# EAGLE schematic loa (EAGLE 5.11)

## Sheet 1 of 7
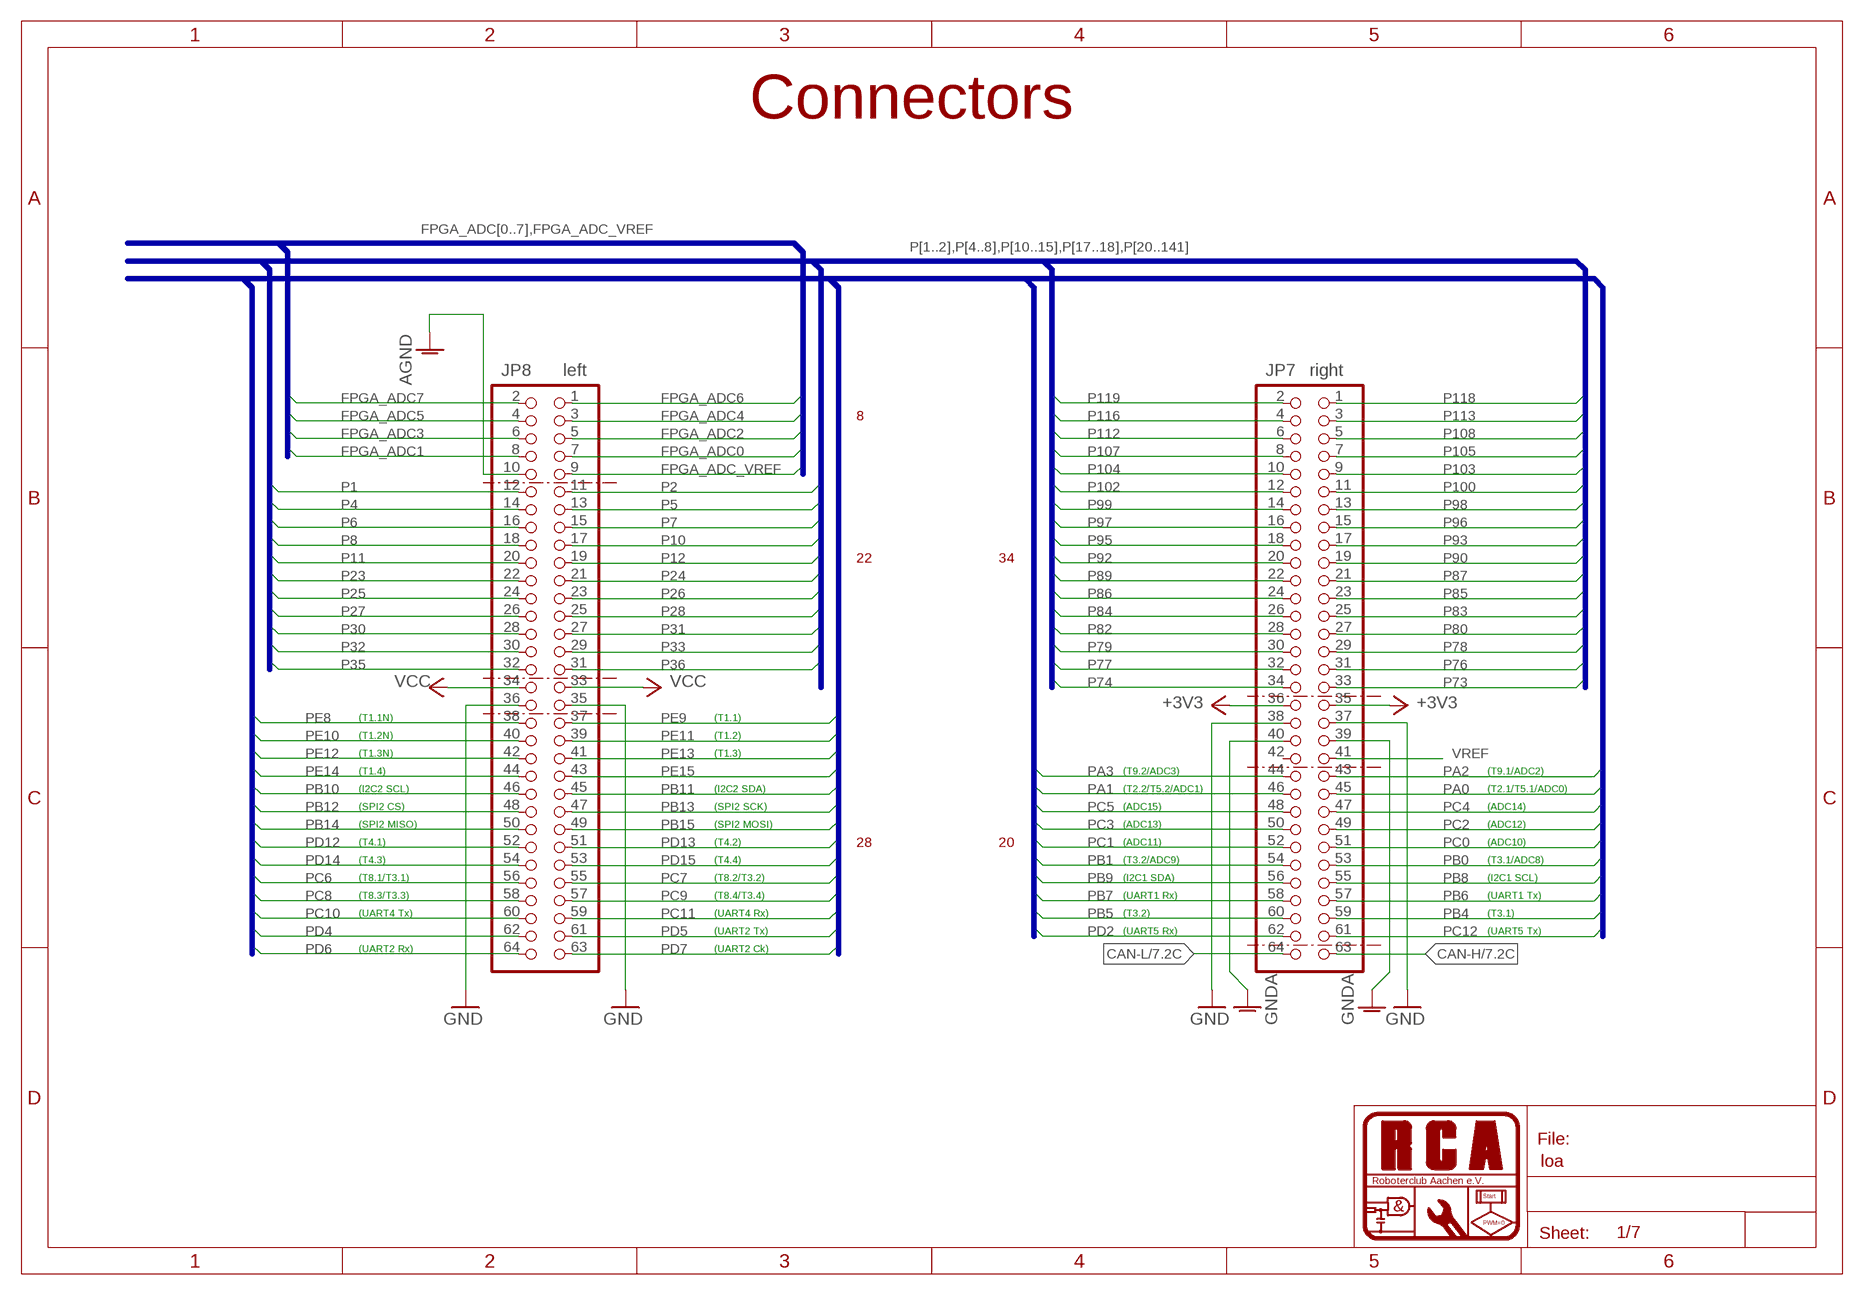
[diagram p0: schematic, sheet 1]

### Parts
JP7  right  PINHD-2X32_2.00-SMD  [2X32M_SMD]
JP8  left  PINHD-2X32_2.00-SMD  [2X32M_SMD]

### Nets
+3V3: JP7.35 JP7.36 ; also sheet 2,3,4,5,6,7
AGND: JP8.10 ; also sheet 3
CAN-H: JP7.63 ; also sheet 7
CAN-L: JP7.64 ; also sheet 7
FPGA_ADC0: JP8.7 ; also sheet 3
FPGA_ADC1: JP8.8 ; also sheet 3
FPGA_ADC2: JP8.5 ; also sheet 3
FPGA_ADC3: JP8.6 ; also sheet 3
FPGA_ADC4: JP8.3 ; also sheet 3
FPGA_ADC5: JP8.4 ; also sheet 3
FPGA_ADC6: JP8.1 ; also sheet 3
FPGA_ADC7: JP8.2 ; also sheet 3
FPGA_ADC_VREF: JP8.9 ; also sheet 3
GND: JP7.37 JP7.38 JP8.35 JP8.36 ; also sheet 2,3,4,5,6,7
GNDA: JP7.39 JP7.40 ; also sheet 6
P1: JP8.12 ; also sheet 2
P2: JP8.11 ; also sheet 2
P4: JP8.14 ; also sheet 2
P5: JP8.13 ; also sheet 2
P6: JP8.16 ; also sheet 2
P7: JP8.15 ; also sheet 2
P8: JP8.18 ; also sheet 2
P10: JP8.17 ; also sheet 2
P11: JP8.20 ; also sheet 2
P12: JP8.19 ; also sheet 2
P23: JP8.22 ; also sheet 2
P24: JP8.21 ; also sheet 2
P25: JP8.24 ; also sheet 2
P26: JP8.23 ; also sheet 2
P27: JP8.26 ; also sheet 2
P28: JP8.25 ; also sheet 2
P30: JP8.28 ; also sheet 2
P31: JP8.27 ; also sheet 2
P32: JP8.30 ; also sheet 2
P33: JP8.29 ; also sheet 2
P35: JP8.32 ; also sheet 2
P36: JP8.31 ; also sheet 2
P73: JP7.33 ; also sheet 2
P74: JP7.34 ; also sheet 2
P76: JP7.31 ; also sheet 2
P77: JP7.32 ; also sheet 2
P78: JP7.29 ; also sheet 2
P79: JP7.30 ; also sheet 2
P80: JP7.27 ; also sheet 2
P82: JP7.28 ; also sheet 2
P83: JP7.25 ; also sheet 2
P84: JP7.26 ; also sheet 2
P85: JP7.23 ; also sheet 2
P86: JP7.24 ; also sheet 2
P87: JP7.21 ; also sheet 2
P89: JP7.22 ; also sheet 2
P90: JP7.19 ; also sheet 2
P92: JP7.20 ; also sheet 2
P93: JP7.17 ; also sheet 2
P95: JP7.18 ; also sheet 2
P96: JP7.15 ; also sheet 2
P97: JP7.16 ; also sheet 2
P98: JP7.13 ; also sheet 2
P99: JP7.14 ; also sheet 2
P100: JP7.11 ; also sheet 2
P102: JP7.12 ; also sheet 2
P103: JP7.9 ; also sheet 2
P104: JP7.10 ; also sheet 2
P105: JP7.7 ; also sheet 2
P107: JP7.8 ; also sheet 2
P108: JP7.5 ; also sheet 2
P112: JP7.6 ; also sheet 2
P113: JP7.3 ; also sheet 2
P116: JP7.4 ; also sheet 2
P118: JP7.1 ; also sheet 2
P119: JP7.2 ; also sheet 2
PA0: JP7.45 ; also sheet 5
PA1: JP7.46 ; also sheet 5
PA2: JP7.43 ; also sheet 5
PA3: JP7.44 ; also sheet 5
PB0: JP7.53 ; also sheet 5
PB1: JP7.54 ; also sheet 5
PB4: JP7.59 ; also sheet 5
PB5: JP7.60 ; also sheet 5
PB6: JP7.57 ; also sheet 5
PB7: JP7.58 ; also sheet 5
PB8: JP7.55 ; also sheet 5
PB9: JP7.56 ; also sheet 5
PB10: JP8.46 ; also sheet 5
PB11: JP8.45 ; also sheet 5
PB12: JP8.48 ; also sheet 5
PB13: JP8.47 ; also sheet 5
PB14: JP8.50 ; also sheet 5
PB15: JP8.49 ; also sheet 5
PC0: JP7.51 ; also sheet 5
PC1: JP7.52 ; also sheet 5
PC2: JP7.49 ; also sheet 5
PC3: JP7.50 ; also sheet 5
PC4: JP7.47 ; also sheet 5
PC5: JP7.48 ; also sheet 5
PC6: JP8.56 ; also sheet 5
PC7: JP8.55 ; also sheet 5
PC8: JP8.58 ; also sheet 5
PC9: JP8.57 ; also sheet 5
PC10: JP8.60 ; also sheet 5
PC11: JP8.59 ; also sheet 5
PC12: JP7.61 ; also sheet 5
PD2: JP7.62 ; also sheet 5
PD4: JP8.62 ; also sheet 5
PD5: JP8.61 ; also sheet 5
PD6: JP8.64 ; also sheet 5
PD7: JP8.63 ; also sheet 5
PD12: JP8.52 ; also sheet 5
PD13: JP8.51 ; also sheet 5
PD14: JP8.54 ; also sheet 5
PD15: JP8.53 ; also sheet 5
PE8: JP8.38 ; also sheet 5
PE9: JP8.37 ; also sheet 5
PE10: JP8.40 ; also sheet 5
PE11: JP8.39 ; also sheet 5
PE12: JP8.42 ; also sheet 5
PE13: JP8.41 ; also sheet 5
PE14: JP8.44 ; also sheet 5
PE15: JP8.43 ; also sheet 5
VCC: JP8.33 JP8.34 ; also sheet 4
VREF: JP7.41 ; also sheet 6
Unconnected: JP7.42

### Buses
FPGA_ADC[0..7],FPGA_ADC_VREF
P[1..2],P[4..8],P[10..15],P[17..18],P[20..141]
PA[0..3],PA8,PB[0..2],PB[4..15],PC[0..12],PC14,FLASH_CS,PD2,SD_CS,PD[4..7],PD[12..15],PE[0..15]

### Notes on the sheet
- Connectors
- 8
- 22 | 34
- (T1.1N) | (T1.1)
- (T1.2N) | (T1.2)
- (T1.3N) | (T1.3)
- (T1.4) | (T9.2/ADC3) | (T9.1/ADC2)
- (I2C2 SCL) | (I2C2 SDA) | (T2.2/T5.2/ADC1) | (T2.1/T5.1/ADC0)
- (SPI2 CS) | (SPI2 SCK) | (ADC15) | (ADC14)
- (SPI2 MISO) | (SPI2 MOSI) | (ADC13) | (ADC12)
- (T4.1) | (T4.2) | 28 | 20 | (ADC11) | (ADC10)
- (T4.3) | (T4.4) | (T3.2/ADC9) | (T3.1/ADC8)
- (T8.1/T3.1) | (T8.2/T3.2) | (I2C1 SDA) | (I2C1 SCL)
- (T8.3/T3.3) | (T8.4/T3.4) | (UART1 Rx) | (UART1 Tx)
- (UART4 Tx) | (UART4 Rx) | (T3.2) | (T3.1)
- (UART2 Tx) | (UART5 Rx) | (UART5 Tx)
- (UART2 Rx) | (UART2 Ck)

## Sheet 2 of 7
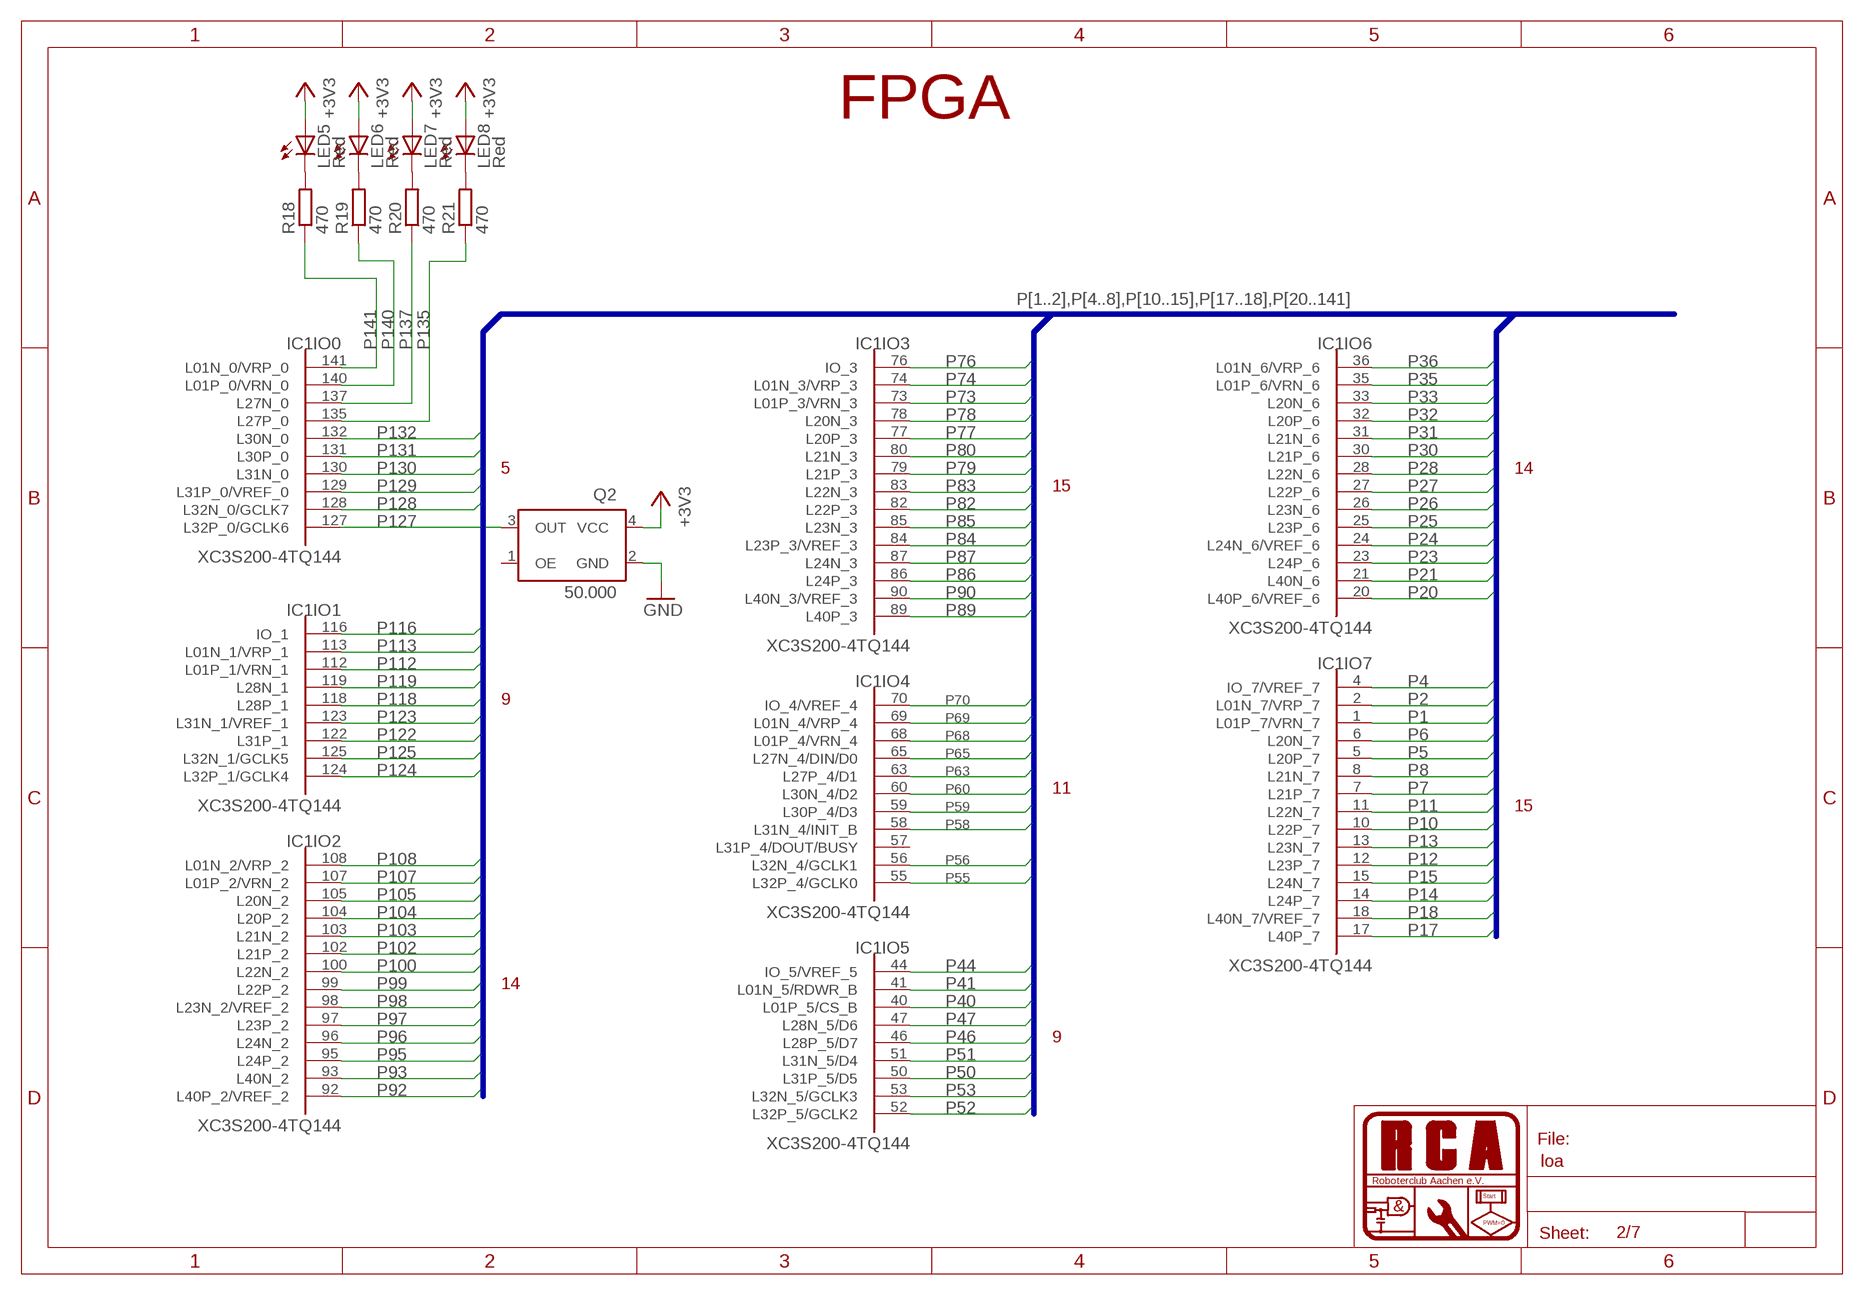
[diagram p1: schematic, sheet 2]

### Parts
IC1  XC3S200-4TQ144  [TQ144]
LED5  Red  LEDCHIPLED_0805  [CHIPLED_0805]
LED6  Red  LEDCHIPLED_0805  [CHIPLED_0805]
LED7  Red  LEDCHIPLED_0805  [CHIPLED_0805]
LED8  Red  LEDCHIPLED_0805  [CHIPLED_0805]
Q2  50.000  XO53  [XO53]
R18  470  R-EU_R0805  [R0805]
R19  470  R-EU_R0805  [R0805]
R20  470  R-EU_R0805  [R0805]
R21  470  R-EU_R0805  [R0805]

### Nets
+3V3: LED5.A LED6.A LED7.A LED8.A Q2.4(VCC) ; also sheet 1,3,4,5,6,7
GND: Q2.2(GND) ; also sheet 1,3,4,5,6,7
N$22: LED8.C R21.2
N$23: LED7.C R20.2
N$24: LED6.C R19.2
N$25: LED5.C R18.2
P1: IC1.1(IO7:L01P_7/VRN_7) ; also sheet 1
P2: IC1.2(IO7:L01N_7/VRP_7) ; also sheet 1
P4: IC1.4(IO7:IO_7/VREF_7) ; also sheet 1
P5: IC1.5(IO7:L20P_7) ; also sheet 1
P6: IC1.6(IO7:L20N_7) ; also sheet 1
P7: IC1.7(IO7:L21P_7) ; also sheet 1
P8: IC1.8(IO7:L21N_7) ; also sheet 1
P10: IC1.10(IO7:L22P_7) ; also sheet 1
P11: IC1.11(IO7:L22N_7) ; also sheet 1
P12: IC1.12(IO7:L23P_7) ; also sheet 1
P13: IC1.13(IO7:L23N_7)
P14: IC1.14(IO7:L24P_7)
P15: IC1.15(IO7:L24N_7)
P17: IC1.17(IO7:L40P_7)
P18: IC1.18(IO7:L40N_7/VREF_7)
P20: IC1.20(IO6:L40P_6/VREF_6) ; also sheet 3
P21: IC1.21(IO6:L40N_6) ; also sheet 3
P23: IC1.23(IO6:L24P_6) ; also sheet 1
P24: IC1.24(IO6:L24N_6/VREF_6) ; also sheet 1
P25: IC1.25(IO6:L23P_6) ; also sheet 1
P26: IC1.26(IO6:L23N_6) ; also sheet 1
P27: IC1.27(IO6:L22P_6) ; also sheet 1
P28: IC1.28(IO6:L22N_6) ; also sheet 1
P30: IC1.30(IO6:L21P_6) ; also sheet 1
P31: IC1.31(IO6:L21N_6) ; also sheet 1
P32: IC1.32(IO6:L20P_6) ; also sheet 1
P33: IC1.33(IO6:L20N_6) ; also sheet 1
P35: IC1.35(IO6:L01P_6/VRN_6) ; also sheet 1
P36: IC1.36(IO6:L01N_6/VRP_6) ; also sheet 1
P40: IC1.40(IO5:L01P_5/CS_B)
P41: IC1.41(IO5:L01N_5/RDWR_B)
P44: IC1.44(IO5:IO_5/VREF_5)
P46: IC1.46(IO5:L28P_5/D7)
P47: IC1.47(IO5:L28N_5/D6)
P50: IC1.50(IO5:L31P_5/D5)
P51: IC1.51(IO5:L31N_5/D4)
P52: IC1.52(IO5:L32P_5/GCLK2)
P53: IC1.53(IO5:L32N_5/GCLK3) ; also sheet 3
P55: IC1.55(IO4:L32P_4/GCLK0) ; also sheet 3
P56: IC1.56(IO4:L32N_4/GCLK1) ; also sheet 3
P58: IC1.58(IO4:L31N_4/INIT_B) ; also sheet 3
P59: IC1.59(IO4:L30P_4/D3) ; also sheet 3
P60: IC1.60(IO4:L30N_4/D2) ; also sheet 3
P63: IC1.63(IO4:L27P_4/D1) ; also sheet 3
P65: IC1.65(IO4:L27N_4/DIN/D0) ; also sheet 3
P68: IC1.68(IO4:L01P_4/VRN_4)
P69: IC1.69(IO4:L01N_4/VRP_4)
P70: IC1.70(IO4:IO_4/VREF_4)
P73: IC1.73(IO3:L01P_3/VRN_3) ; also sheet 1
P74: IC1.74(IO3:L01N_3/VRP_3) ; also sheet 1
P76: IC1.76(IO3:IO_3) ; also sheet 1
P77: IC1.77(IO3:L20P_3) ; also sheet 1
P78: IC1.78(IO3:L20N_3) ; also sheet 1
P79: IC1.79(IO3:L21P_3) ; also sheet 1
P80: IC1.80(IO3:L21N_3) ; also sheet 1
P82: IC1.82(IO3:L22P_3) ; also sheet 1
P83: IC1.83(IO3:L22N_3) ; also sheet 1
P84: IC1.84(IO3:L23P_3/VREF_3) ; also sheet 1
P85: IC1.85(IO3:L23N_3) ; also sheet 1
P86: IC1.86(IO3:L24P_3) ; also sheet 1
P87: IC1.87(IO3:L24N_3) ; also sheet 1
P89: IC1.89(IO3:L40P_3) ; also sheet 1
P90: IC1.90(IO3:L40N_3/VREF_3) ; also sheet 1
P92: IC1.92(IO2:L40P_2/VREF_2) ; also sheet 1
P93: IC1.93(IO2:L40N_2) ; also sheet 1
P95: IC1.95(IO2:L24P_2) ; also sheet 1
P96: IC1.96(IO2:L24N_2) ; also sheet 1
P97: IC1.97(IO2:L23P_2) ; also sheet 1
P98: IC1.98(IO2:L23N_2/VREF_2) ; also sheet 1
P99: IC1.99(IO2:L22P_2) ; also sheet 1
P100: IC1.100(IO2:L22N_2) ; also sheet 1
P102: IC1.102(IO2:L21P_2) ; also sheet 1
P103: IC1.103(IO2:L21N_2) ; also sheet 1
P104: IC1.104(IO2:L20P_2) ; also sheet 1
P105: IC1.105(IO2:L20N_2) ; also sheet 1
P107: IC1.107(IO2:L01P_2/VRN_2) ; also sheet 1
P108: IC1.108(IO2:L01N_2/VRP_2) ; also sheet 1
P112: IC1.112(IO1:L01P_1/VRN_1) ; also sheet 1
P113: IC1.113(IO1:L01N_1/VRP_1) ; also sheet 1
P116: IC1.116(IO1:IO_1) ; also sheet 1
P118: IC1.118(IO1:L28P_1) ; also sheet 1
P119: IC1.119(IO1:L28N_1) ; also sheet 1
P122: IC1.122(IO1:L31P_1) ; also sheet 3
P123: IC1.123(IO1:L31N_1/VREF_1) ; also sheet 3
P124: IC1.124(IO1:L32P_1/GCLK4) ; also sheet 3
P125: IC1.125(IO1:L32N_1/GCLK5) ; also sheet 3
P127: IC1.127(IO0:L32P_0/GCLK6) Q2.3(OUT)
P128: IC1.128(IO0:L32N_0/GCLK7)
P129: IC1.129(IO0:L31P_0/VREF_0)
P130: IC1.130(IO0:L31N_0)
P131: IC1.131(IO0:L30P_0)
P132: IC1.132(IO0:L30N_0)
P135: IC1.135(IO0:L27P_0) R21.1
P137: IC1.137(IO0:L27N_0) R20.1
P140: IC1.140(IO0:L01P_0/VRN_0) R19.1
P141: IC1.141(IO0:L01N_0/VRP_0) R18.1
Unconnected: IC1.57(IO4:L31P_4/DOUT/BUSY) Q2.1(OE)

### Buses
P[1..2],P[4..8],P[10..15],P[17..18],P[20..141]

### Notes on the sheet
- FPGA
- 5 | 14
- 15
- 9
- 11
- 15
- 14
- 9

## Sheet 3 of 7
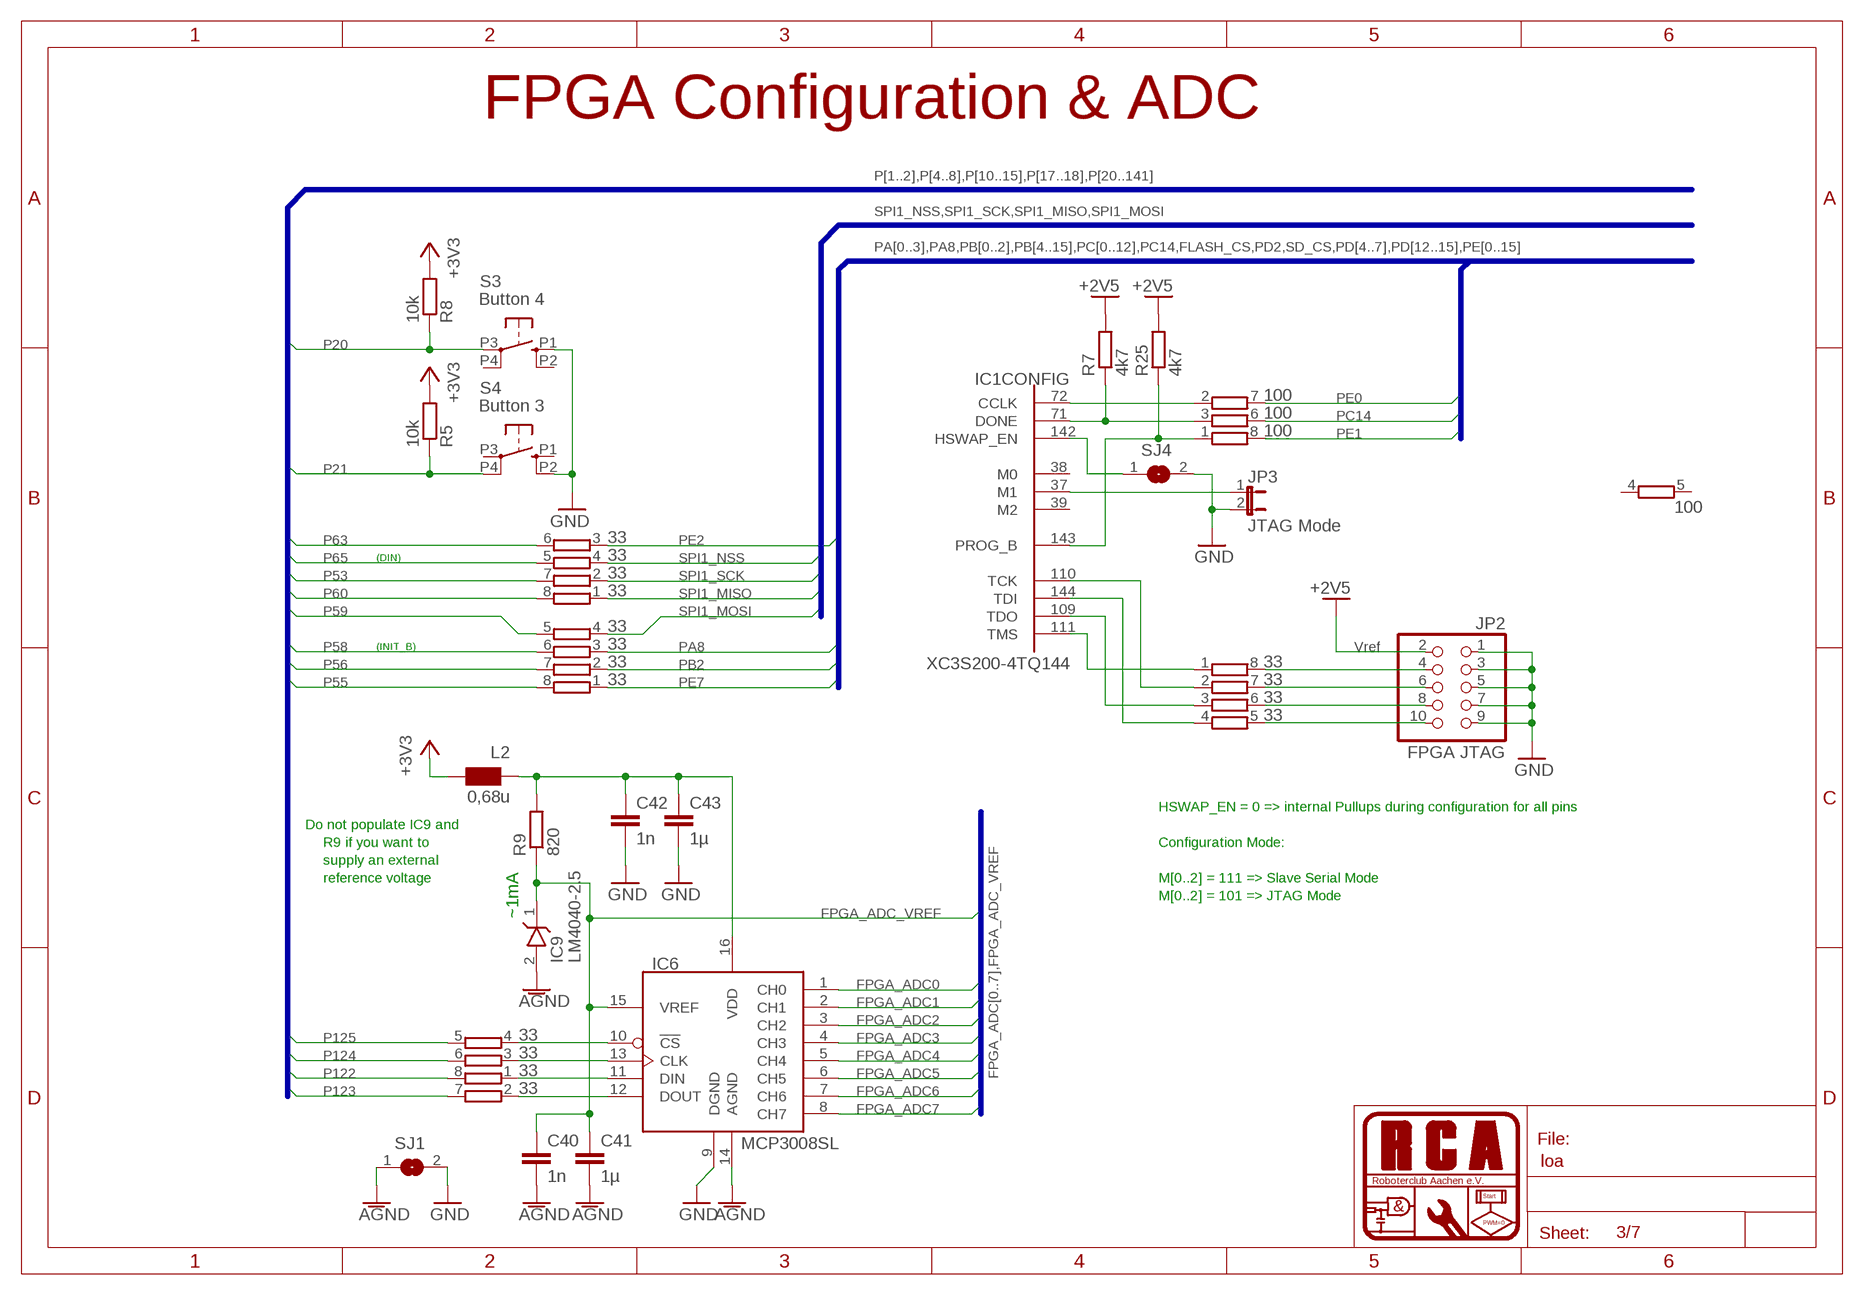
[diagram p2: schematic, sheet 3]

### Parts
C40  1n  C-EUC0603  [C0603]
C41  1µ  C-EUC0805  [C0805]
C42  1n  C-EUC0603  [C0603]
C43  1µ  C-EUC0805  [C0805]
IC6  MCP3008SL  [SO16]
IC9  LM4040-2.5  LM4040  [SOT23]
JP2  FPGA JTAG  PINHD-2X5_2.54-SMD  [2X05SMD]
JP3  JTAG Mode  JP1E  [JP1]
L2  0,68u  WE-KIHQ_0805  [WE-KI_0805_B]
R5  10k  R-EU_R0805  [R0805]
R7  4k7  R-EU_R0805  [R0805]
R8  10k  R-EU_R0805  [R0805]
R9  820  R-EU_R0805  [R0805]
R25  4k7  R-EU_R0805  [R0805]
RN1  33  4R-NEXB38V  [EXB38V]
RN2  33  4R-NEXB38V  [EXB38V]
RN3  33  4R-NEXB38V  [EXB38V]
RN4  100  4R-NEXB38V  [EXB38V]
RN5  33  4R-NEXB38V  [EXB38V]
S3  Button 4  10-XXLSH  [B3F-10XX-SMD]
S4  Button 3  10-XXLSH  [B3F-10XX-SMD]
SJ1  SJ  [SJ]
SJ4  SJ  [SJ]

### Nets
+2V5: JP2.2 R7.2 R25.2 ; also sheet 4
+3V3: L2.1 R5.2 R8.2 ; also sheet 1,2,4,5,6,7
AGND: C40.2 C41.2 IC6.14(AGND) IC9.2(A) SJ1.1 ; also sheet 1
FPGA_ADC0: IC6.1(CH0) ; also sheet 1
FPGA_ADC1: IC6.2(CH1) ; also sheet 1
FPGA_ADC2: IC6.3(CH2) ; also sheet 1
FPGA_ADC3: IC6.4(CH3) ; also sheet 1
FPGA_ADC4: IC6.5(CH4) ; also sheet 1
FPGA_ADC5: IC6.6(CH5) ; also sheet 1
FPGA_ADC6: IC6.7(CH6) ; also sheet 1
FPGA_ADC7: IC6.8(CH7) ; also sheet 1
FPGA_ADC_VREF: C40.1 C41.1 IC6.15(VREF) IC9.1(C) R9.1 ; also sheet 1
GND: C42.2 C43.2 IC6.9(DGND) JP2.1 JP2.3 JP2.5 JP2.7 JP2.9 JP3.2 S3.P1(S) S4.P2(S1) SJ1.2 SJ4.2 ; also sheet 1,2,4,5,6,7
N$2: IC1.143(CONFIG:PROG_B) R25.1 RN4.1
N$3: IC1.71(CONFIG:DONE) R7.1 RN4.3
N$5: IC1.37(CONFIG:M1) JP3.1
N$6: IC1.142(CONFIG:HSWAP_EN) SJ4.1
N$7: IC1.72(CONFIG:CCLK) RN4.2
N$8: IC1.110(CONFIG:TCK) RN3.2
N$9: IC1.144(CONFIG:TDI) RN3.4
N$10: IC1.109(CONFIG:TDO) RN3.3
N$11: IC1.111(CONFIG:TMS) RN3.1
N$12: JP2.6 RN3.7
N$13: JP2.8 RN3.6
N$14: JP2.10 RN3.5
N$15: JP2.4 RN3.8
N$32: IC6.11(DIN) RN5.1
N$37: C42.1 C43.1 IC6.16(VDD) L2.2 R9.2
N$38: IC6.13(CLK) RN5.3
N$39: IC6.12(DOUT) RN5.2
N$41: IC6.10(!CS) RN5.4
P20: R8.1 S3.P3(P) ; also sheet 2
P21: R5.1 S4.P4(P1) ; also sheet 2
P53: RN1.7 ; also sheet 2
P55: RN2.8 ; also sheet 2
P56: RN2.7 ; also sheet 2
P58: RN2.6 ; also sheet 2
P59: RN2.5 ; also sheet 2
P60: RN1.8 ; also sheet 2
P63: RN1.6 ; also sheet 2
P65: RN1.5 ; also sheet 2
P122: RN5.8 ; also sheet 2
P123: RN5.7 ; also sheet 2
P124: RN5.6 ; also sheet 2
P125: RN5.5 ; also sheet 2
PA8: RN2.3 ; also sheet 5
PB2: RN2.2 ; also sheet 5
PC14: RN4.6 ; also sheet 5
PE0: RN4.7 ; also sheet 5
PE1: RN4.8 ; also sheet 5
PE2: RN1.3 ; also sheet 5
PE7: RN2.1 ; also sheet 5
SPI1_MISO: RN1.1 ; also sheet 5
SPI1_MOSI: RN2.4 ; also sheet 5
SPI1_NSS: RN1.4 ; also sheet 5
SPI1_SCK: RN1.2 ; also sheet 5
Unconnected: IC1.38(CONFIG:M0) IC1.39(CONFIG:M2) RN4.4 RN4.5 S3.P2(S1) S3.P4(P1) S4.P1(S) S4.P3(P)

### Buses
P[1..2],P[4..8],P[10..15],P[17..18],P[20..141]
SPI1_NSS,SPI1_SCK,SPI1_MISO,SPI1_MOSI
PA[0..3],PA8,PB[0..2],PB[4..15],PC[0..12],PC14,FLASH_CS,PD2,SD_CS,PD[4..7],PD[12..15],PE[0..15]
FPGA_ADC[0..7],FPGA_ADC_VREF

### Notes on the sheet
- FPGA Configuration & ADC
- (DIN)
- (INIT_B) | Vref
- HSWAP_EN = 0 => internal Pullups during configuration for all pins
- Do not populate IC9 and
- R9 if you want to | Configuration Mode:
- supply an external
- reference voltage | M[0..2] = 111 => Slave Serial Mode
- M[0..2] = 101 => JTAG Mode
- ~1mA

## Sheet 4 of 7
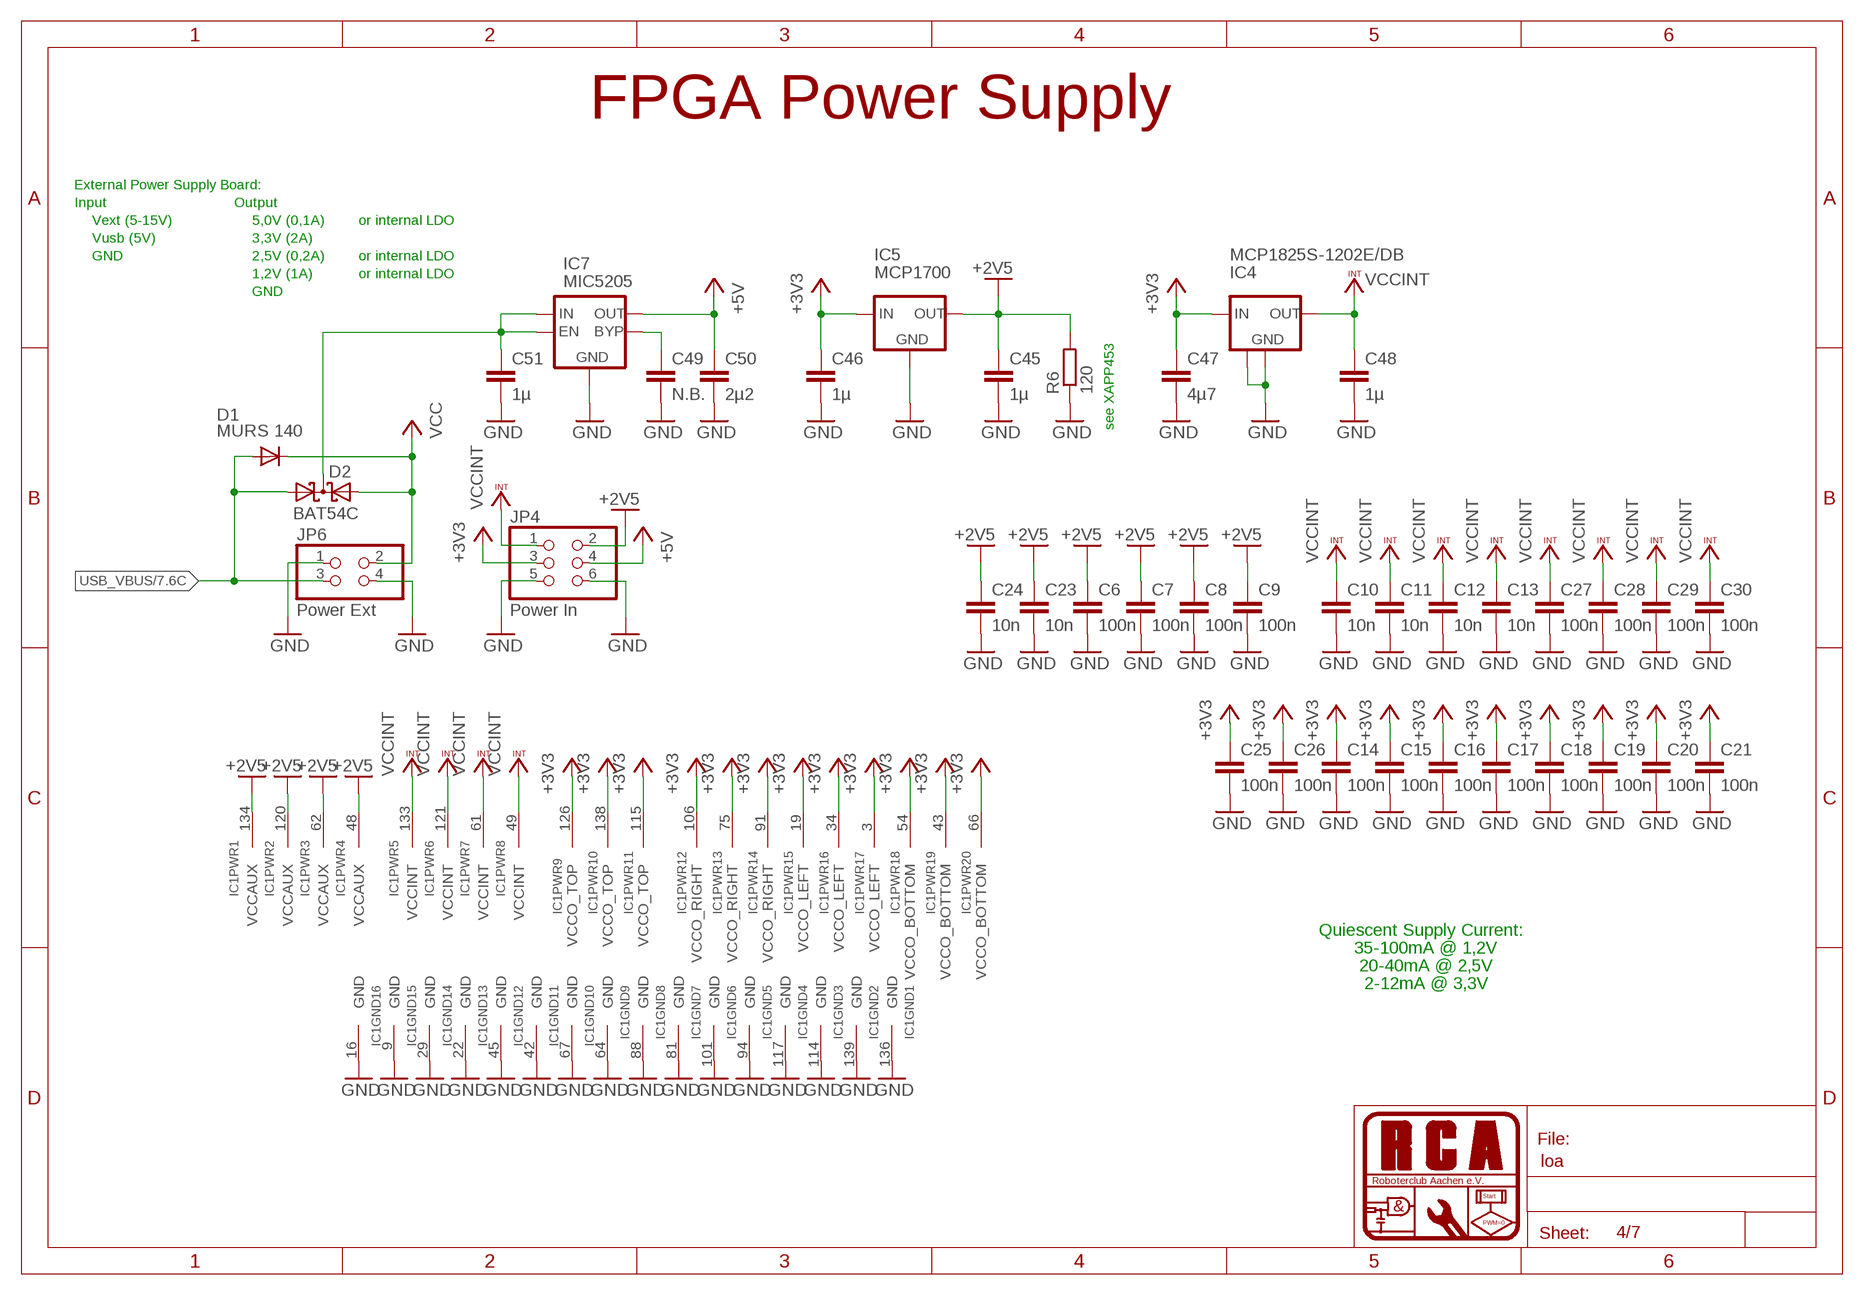
[diagram p3: schematic, sheet 4]

### Parts
C6  100n  C-EUC0603  [C0603]
C7  100n  C-EUC0603  [C0603]
C8  100n  C-EUC0603  [C0603]
C9  100n  C-EUC0603  [C0603]
C10  10n  C-EUC0603  [C0603]
C11  10n  C-EUC0603  [C0603]
C12  10n  C-EUC0603  [C0603]
C13  10n  C-EUC0603  [C0603]
C14  100n  C-EUC0603  [C0603]
C15  100n  C-EUC0603  [C0603]
C16  100n  C-EUC0603  [C0603]
C17  100n  C-EUC0603  [C0603]
C18  100n  C-EUC0603  [C0603]
C19  100n  C-EUC0603  [C0603]
C20  100n  C-EUC0603  [C0603]
C21  100n  C-EUC0603  [C0603]
C23  10n  C-EUC0603  [C0603]
C24  10n  C-EUC0603  [C0603]
C25  100n  C-EUC0603  [C0603]
C26  100n  C-EUC0603  [C0603]
C27  100n  C-EUC0603  [C0603]
C28  100n  C-EUC0603  [C0603]
C29  100n  C-EUC0603  [C0603]
C30  100n  C-EUC0603  [C0603]
C45  1µ  C-EUC0805  [C0805]
C46  1µ  C-EUC0805  [C0805]
C47  4µ7  C-EUC0805  [C0805]
C48  1µ  C-EUC0805  [C0805]
C49  N.B.  C-EUC0805  [C0805]
C50  2µ2  C-EUC0805  [C0805]
C51  1µ  C-EUC0805  [C0805]
D1  MURS 140  DIODE-SMB  [SMB]
D2  BAT54C  [SOT23]
IC4  MCP1825S-1202E/DB  MCP1825DB  [SOT223]
IC5  MCP1700  [SOT23]
IC7  MIC5205  [SOT23-5L]
JP4  Power In  PINHD-2X3_2.54  [2X03]
JP6  Power Ext  PINHD-2X2_2.54  [2X02]
R6  120  R-EU_M0805  [M0805]

### Nets
+2V5: C6.1 C7.1 C8.1 C9.1 C23.1 C24.1 C45.1 IC1.48(PWR4:VCCAUX) IC1.62(PWR3:VCCAUX) IC1.120(PWR2:VCCAUX) IC1.134(PWR1:VCCAUX) IC5.2(OUT) JP4.2 R6.2 ; also sheet 3
+3V3: C14.1 C15.1 C16.1 C17.1 C18.1 C19.1 C20.1 C21.1 C25.1 C26.1 C46.1 C47.1 IC1.3(PWR17:VCCO_LEFT) IC1.19(PWR15:VCCO_LEFT) IC1.34(PWR16:VCCO_LEFT) IC1.43(PWR19:VCCO_BOTTOM) IC1.54(PWR18:VCCO_BOTTOM) IC1.66(PWR20:VCCO_BOTTOM) IC1.75(PWR13:VCCO_RIGHT) IC1.91(PWR14:VCCO_RIGHT) IC1.106(PWR12:VCCO_RIGHT) IC1.115(PWR11:VCCO_TOP) IC1.126(PWR9:VCCO_TOP) IC1.138(PWR10:VCCO_TOP) IC4.1(IN) IC5.3(IN) JP4.3 ; also sheet 1,2,3,5,6,7
+5V: C50.1 IC7.5(OUT) JP4.4 ; also sheet 7
GND: C6.2 C7.2 C8.2 C9.2 C10.2 C11.2 C12.2 C13.2 C14.2 C15.2 C16.2 C17.2 C18.2 C19.2 C20.2 C21.2 C23.2 C24.2 C25.2 C26.2 C27.2 C28.2 C29.2 C30.2 C45.2 C46.2 C47.2 C48.2 C49.2 C50.2 C51.2 IC1.9(GND15:GND) IC1.16(GND16:GND) IC1.22(GND13:GND) IC1.29(GND14:GND) IC1.42(GND11:GND) IC1.45(GND12:GND) IC1.64(GND9:GND) IC1.67(GND10:GND) IC1.81(GND7:GND) IC1.88(GND8:GND) IC1.94(GND5:GND) IC1.101(GND6:GND) IC1.114(GND3:GND) IC1.117(GND4:GND) IC1.136(GND1:GND) IC1.139(GND2:GND) IC4.2(GND) IC4.4(GND) IC5.1(GND) IC7.2(GND) JP4.5 JP4.6 JP6.1 JP6.4 R6.1 ; also sheet 1,2,3,5,6,7
N$40: C49.1 IC7.4(BYP)
N$43: C51.1 D2.3(CC) IC7.1(IN) IC7.3(EN)
USB_VBUS: D1.A D2.1(A1) JP6.3 ; also sheet 5,7
VCC: D1.C D2.2(A2) JP6.2 ; also sheet 1
VCCINT: C10.1 C11.1 C12.1 C13.1 C27.1 C28.1 C29.1 C30.1 C48.1 IC1.49(PWR8:VCCINT) IC1.61(PWR7:VCCINT) IC1.121(PWR6:VCCINT) IC1.133(PWR5:VCCINT) IC4.3(OUT) JP4.1

### Notes on the sheet
- FPGA Power Supply
- External Power Supply Board:
- Input | Output
- Vext (5-15V) | 5,0V (0,1A) | or internal LDO
- Vusb (5V) | 3,3V (2A)
- GND | 2,5V (0,2A) | or internal LDO
- 1,2V (1A) | or internal LDO
- GND
- see XAPP453
- Quiescent Supply Current:
- 35-100mA @ 1,2V
- 20-40mA @ 2,5V
- 2-12mA @ 3,3V

## Sheet 5 of 7
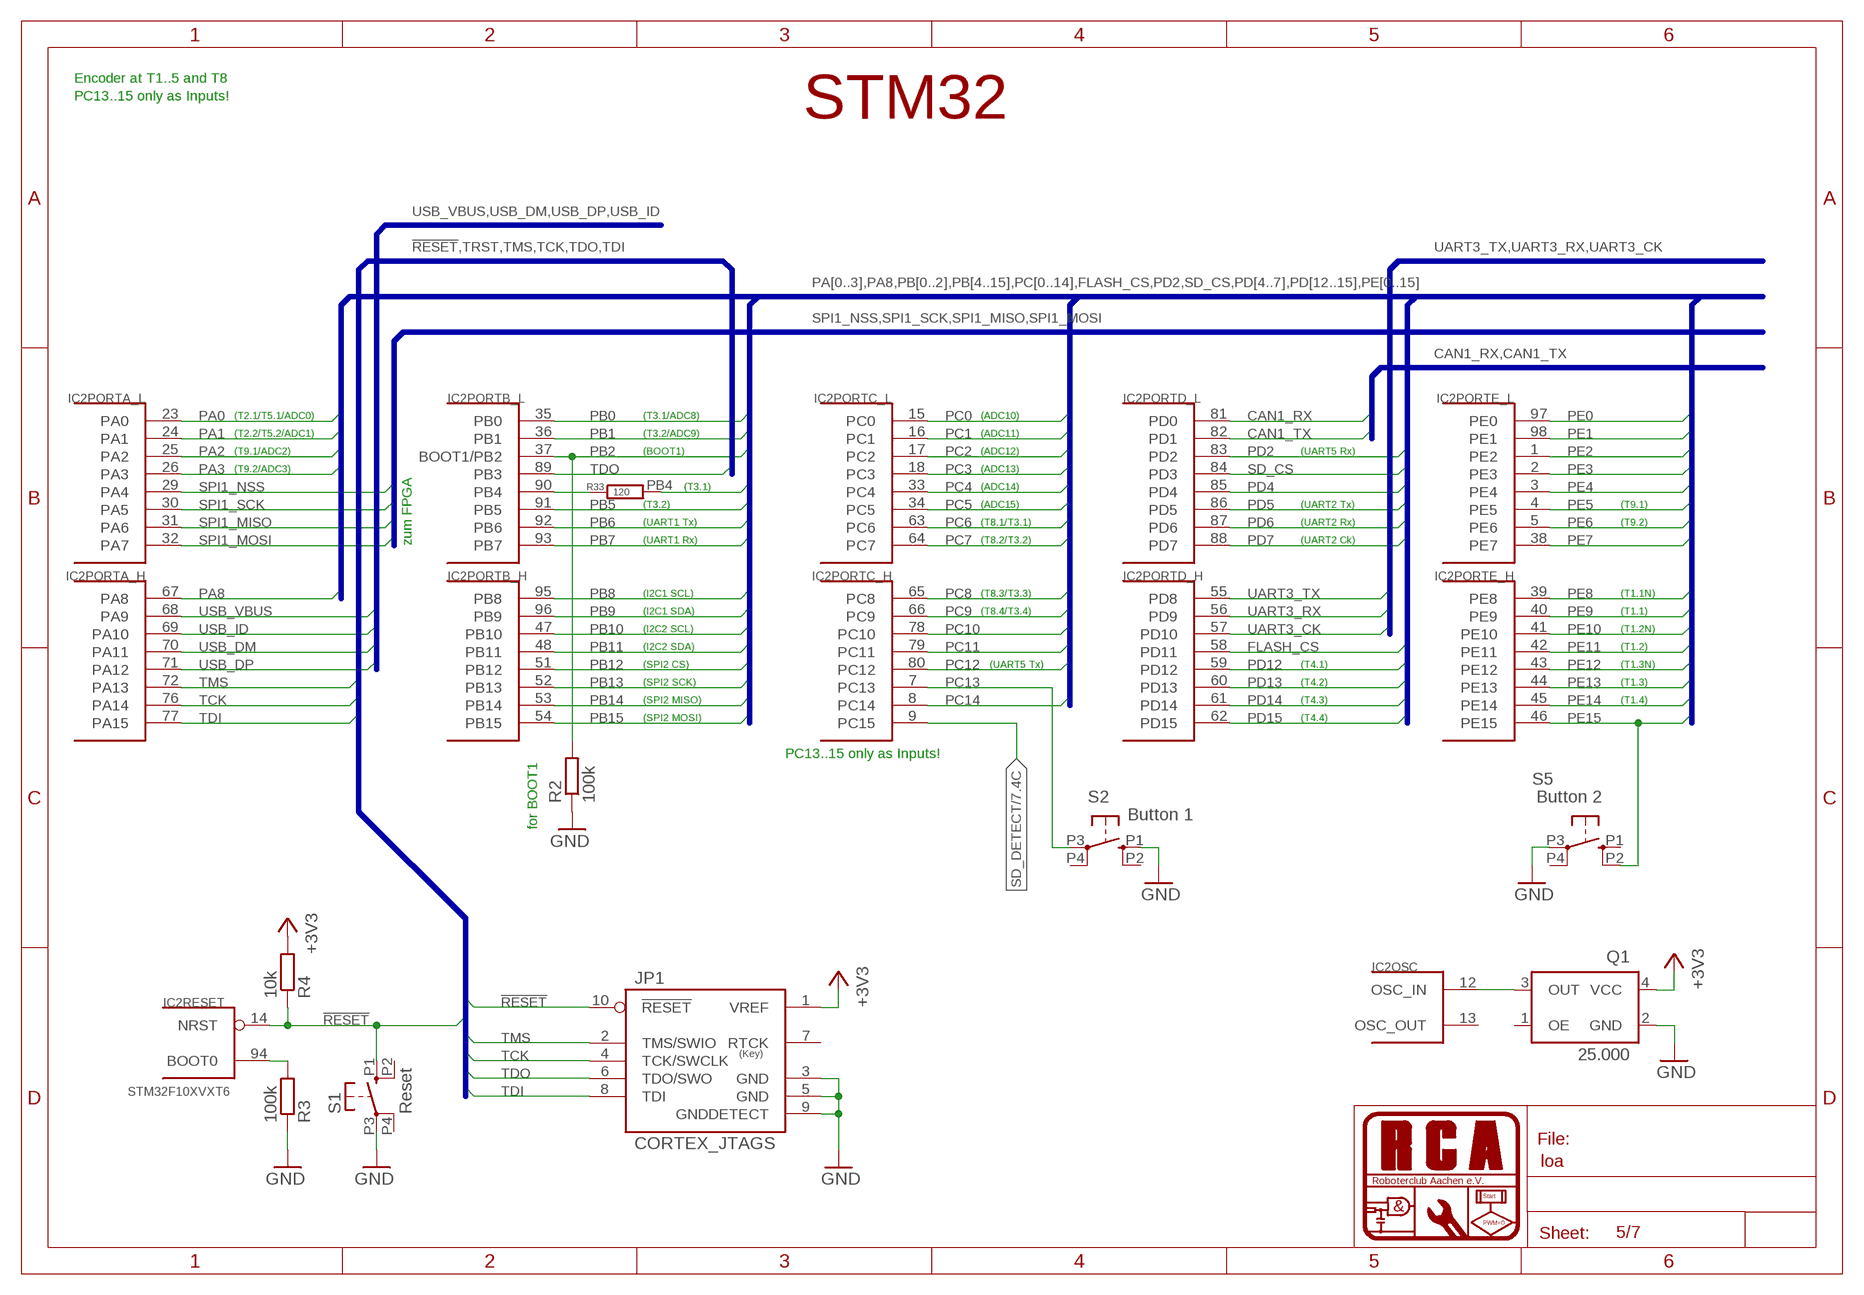
[diagram p4: schematic, sheet 5]

### Parts
IC2  STM32F10XVXT6  [TQFP100]
JP1  CORTEX_JTAGS  [2X05SMD]
Q1  25.000  XO53  [XO53]
R2  100k  R-EU_R0805  [R0805]
R3  100k  R-EU_R0805  [R0805]
R4  10k  R-EU_R0805  [R0805]
R33  120  R-EU_R0805  [R0805]
S1  Reset  10-XXLSH  [B3F-10XX-SMD]
S2  Button 1  10-XXLSH  [B3F-10XX-SMD]
S5  Button 2  10-XXLSH  [B3F-10XX-SMD]

### Nets
!RESET: IC2.14(RESET:NRST) JP1.10(!RESET) R4.1 S1.P1(S)
+3V3: JP1.1(VREF) Q1.4(VCC) R4.2 ; also sheet 1,2,3,4,6,7
CAN1_RX: IC2.81(PORTD_L:PD0) ; also sheet 7
CAN1_TX: IC2.82(PORTD_L:PD1) ; also sheet 7
FLASH_CS: IC2.58(PORTD_H:PD11) ; also sheet 7
GND: JP1.3(GND) JP1.5(GND) JP1.9(GNDDETECT) Q1.2(GND) R2.1 R3.1 S1.P3(P) S2.P1(S) S5.P3(P) ; also sheet 1,2,3,4,6,7
N$1: IC2.12(OSC:OSC_IN) Q1.3(OUT)
N$4: IC2.94(RESET:BOOT0) R3.2
N$34: IC2.90(PORTB_L:PB4) R33.1
PA0: IC2.23(PORTA_L:PA0) ; also sheet 1
PA1: IC2.24(PORTA_L:PA1) ; also sheet 1
PA2: IC2.25(PORTA_L:PA2) ; also sheet 1
PA3: IC2.26(PORTA_L:PA3) ; also sheet 1
PA8: IC2.67(PORTA_H:PA8) ; also sheet 3
PB0: IC2.35(PORTB_L:PB0) ; also sheet 1
PB1: IC2.36(PORTB_L:PB1) ; also sheet 1
PB2: IC2.37(PORTB_L:BOOT1/PB2) R2.2 ; also sheet 3
PB4: R33.2 ; also sheet 1
PB5: IC2.91(PORTB_L:PB5) ; also sheet 1
PB6: IC2.92(PORTB_L:PB6) ; also sheet 1
PB7: IC2.93(PORTB_L:PB7) ; also sheet 1
PB8: IC2.95(PORTB_H:PB8) ; also sheet 1
PB9: IC2.96(PORTB_H:PB9) ; also sheet 1
PB10: IC2.47(PORTB_H:PB10) ; also sheet 1
PB11: IC2.48(PORTB_H:PB11) ; also sheet 1
PB12: IC2.51(PORTB_H:PB12) ; also sheet 1
PB13: IC2.52(PORTB_H:PB13) ; also sheet 1
PB14: IC2.53(PORTB_H:PB14) ; also sheet 1
PB15: IC2.54(PORTB_H:PB15) ; also sheet 1
PC0: IC2.15(PORTC_L:PC0) ; also sheet 1
PC1: IC2.16(PORTC_L:PC1) ; also sheet 1
PC2: IC2.17(PORTC_L:PC2) ; also sheet 1
PC3: IC2.18(PORTC_L:PC3) ; also sheet 1
PC4: IC2.33(PORTC_L:PC4) ; also sheet 1
PC5: IC2.34(PORTC_L:PC5) ; also sheet 1
PC6: IC2.63(PORTC_L:PC6) ; also sheet 1
PC7: IC2.64(PORTC_L:PC7) ; also sheet 1
PC8: IC2.65(PORTC_H:PC8) ; also sheet 1
PC9: IC2.66(PORTC_H:PC9) ; also sheet 1
PC10: IC2.78(PORTC_H:PC10) ; also sheet 1
PC11: IC2.79(PORTC_H:PC11) ; also sheet 1
PC12: IC2.80(PORTC_H:PC12) ; also sheet 1
PC13: IC2.7(PORTC_H:PC13) S2.P3(P)
PC14: IC2.8(PORTC_H:PC14) ; also sheet 3
PD2: IC2.83(PORTD_L:PD2) ; also sheet 1
PD4: IC2.85(PORTD_L:PD4) ; also sheet 1
PD5: IC2.86(PORTD_L:PD5) ; also sheet 1
PD6: IC2.87(PORTD_L:PD6) ; also sheet 1
PD7: IC2.88(PORTD_L:PD7) ; also sheet 1
PD12: IC2.59(PORTD_H:PD12) ; also sheet 1
PD13: IC2.60(PORTD_H:PD13) ; also sheet 1
PD14: IC2.61(PORTD_H:PD14) ; also sheet 1
PD15: IC2.62(PORTD_H:PD15) ; also sheet 1
PE0: IC2.97(PORTE_L:PE0) ; also sheet 3
PE1: IC2.98(PORTE_L:PE1) ; also sheet 3
PE2: IC2.1(PORTE_L:PE2) ; also sheet 3
PE3: IC2.2(PORTE_L:PE3) ; also sheet 7
PE4: IC2.3(PORTE_L:PE4) ; also sheet 7
PE5: IC2.4(PORTE_L:PE5) ; also sheet 7
PE6: IC2.5(PORTE_L:PE6) ; also sheet 7
PE7: IC2.38(PORTE_L:PE7) ; also sheet 3
PE8: IC2.39(PORTE_H:PE8) ; also sheet 1
PE9: IC2.40(PORTE_H:PE9) ; also sheet 1
PE10: IC2.41(PORTE_H:PE10) ; also sheet 1
PE11: IC2.42(PORTE_H:PE11) ; also sheet 1
PE12: IC2.43(PORTE_H:PE12) ; also sheet 1
PE13: IC2.44(PORTE_H:PE13) ; also sheet 1
PE14: IC2.45(PORTE_H:PE14) ; also sheet 1
PE15: IC2.46(PORTE_H:PE15) S5.P2(S1) ; also sheet 1
SD_CS: IC2.84(PORTD_L:PD3) ; also sheet 7
SD_DETECT: IC2.9(PORTC_H:PC15) ; also sheet 7
SPI1_MISO: IC2.31(PORTA_L:PA6) ; also sheet 3
SPI1_MOSI: IC2.32(PORTA_L:PA7) ; also sheet 3
SPI1_NSS: IC2.29(PORTA_L:PA4) ; also sheet 3
SPI1_SCK: IC2.30(PORTA_L:PA5) ; also sheet 3
TCK: IC2.76(PORTA_H:PA14) JP1.4(TCK/SWCLK)
TDI: IC2.77(PORTA_H:PA15) JP1.8(TDI)
TDO: IC2.89(PORTB_L:PB3) JP1.6(TDO/SWO)
TMS: IC2.72(PORTA_H:PA13) JP1.2(TMS/SWIO)
UART3_CK: IC2.57(PORTD_H:PD10) ; also sheet 7
UART3_RX: IC2.56(PORTD_H:PD9) ; also sheet 7
UART3_TX: IC2.55(PORTD_H:PD8) ; also sheet 7
USB_DM: IC2.70(PORTA_H:PA11) ; also sheet 7
USB_DP: IC2.71(PORTA_H:PA12) ; also sheet 7
USB_ID: IC2.69(PORTA_H:PA10) ; also sheet 7
USB_VBUS: IC2.68(PORTA_H:PA9) ; also sheet 4,7
Unconnected: IC2.13(OSC:OSC_OUT) JP1.7(RTCK) Q1.1(OE) S1.P2(S1) S1.P4(P1) S2.P2(S1) S2.P4(P1) S5.P1(S) S5.P4(P1)

### Buses
!RESET,TRST,TMS,TCK,TDO,TDI
USB_VBUS,USB_DM,USB_DP,USB_ID
SPI1_NSS,SPI1_SCK,SPI1_MISO,SPI1_MOSI
CAN1_RX,CAN1_TX
PA[0..3],PA8,PB[0..2],PB[4..15],PC[0..14],FLASH_CS,PD2,SD_CS,PD[4..7],PD[12..15],PE[0..15]
UART3_TX,UART3_RX,UART3_CK

### Notes on the sheet
- Encoder at T1..5 and T8
- PC13..15 only as Inputs!
- STM32
- (T2.1/T5.1/ADC0) | (T3.1/ADC8) | (ADC10)
- (T2.2/T5.2/ADC1) | (T3.2/ADC9) | (ADC11)
- (T9.1/ADC2) | (BOOT1) | (ADC12) | (UART5 Rx)
- (T9.2/ADC3) | (ADC13)
- (T3.1) | (ADC14)
- (T3.2) | (ADC15) | (UART2 Tx) | (T9.1)
- (UART1 Tx) | (T8.1/T3.1) | (UART2 Rx) | (T9.2)
- zum FPGA | (UART1 Rx) | (T8.2/T3.2) | (UART2 Ck)
- (I2C1 SCL) | (T8.3/T3.3) | (T1.1N)
- (I2C1 SDA) | (T8.4/T3.4) | (T1.1)
- (I2C2 SCL) | (T1.2N)
- (I2C2 SDA) | (T1.2)
- (SPI2 CS) | (UART5 Tx) | (T4.1) | (T1.3N)
- (SPI2 SCK) | (T4.2) | (T1.3)
- (SPI2 MISO) | (T4.3) | (T1.4)
- (SPI2 MOSI) | (T4.4)
- PC13..15 only as Inputs!
- for BOOT1

## Sheet 6 of 7
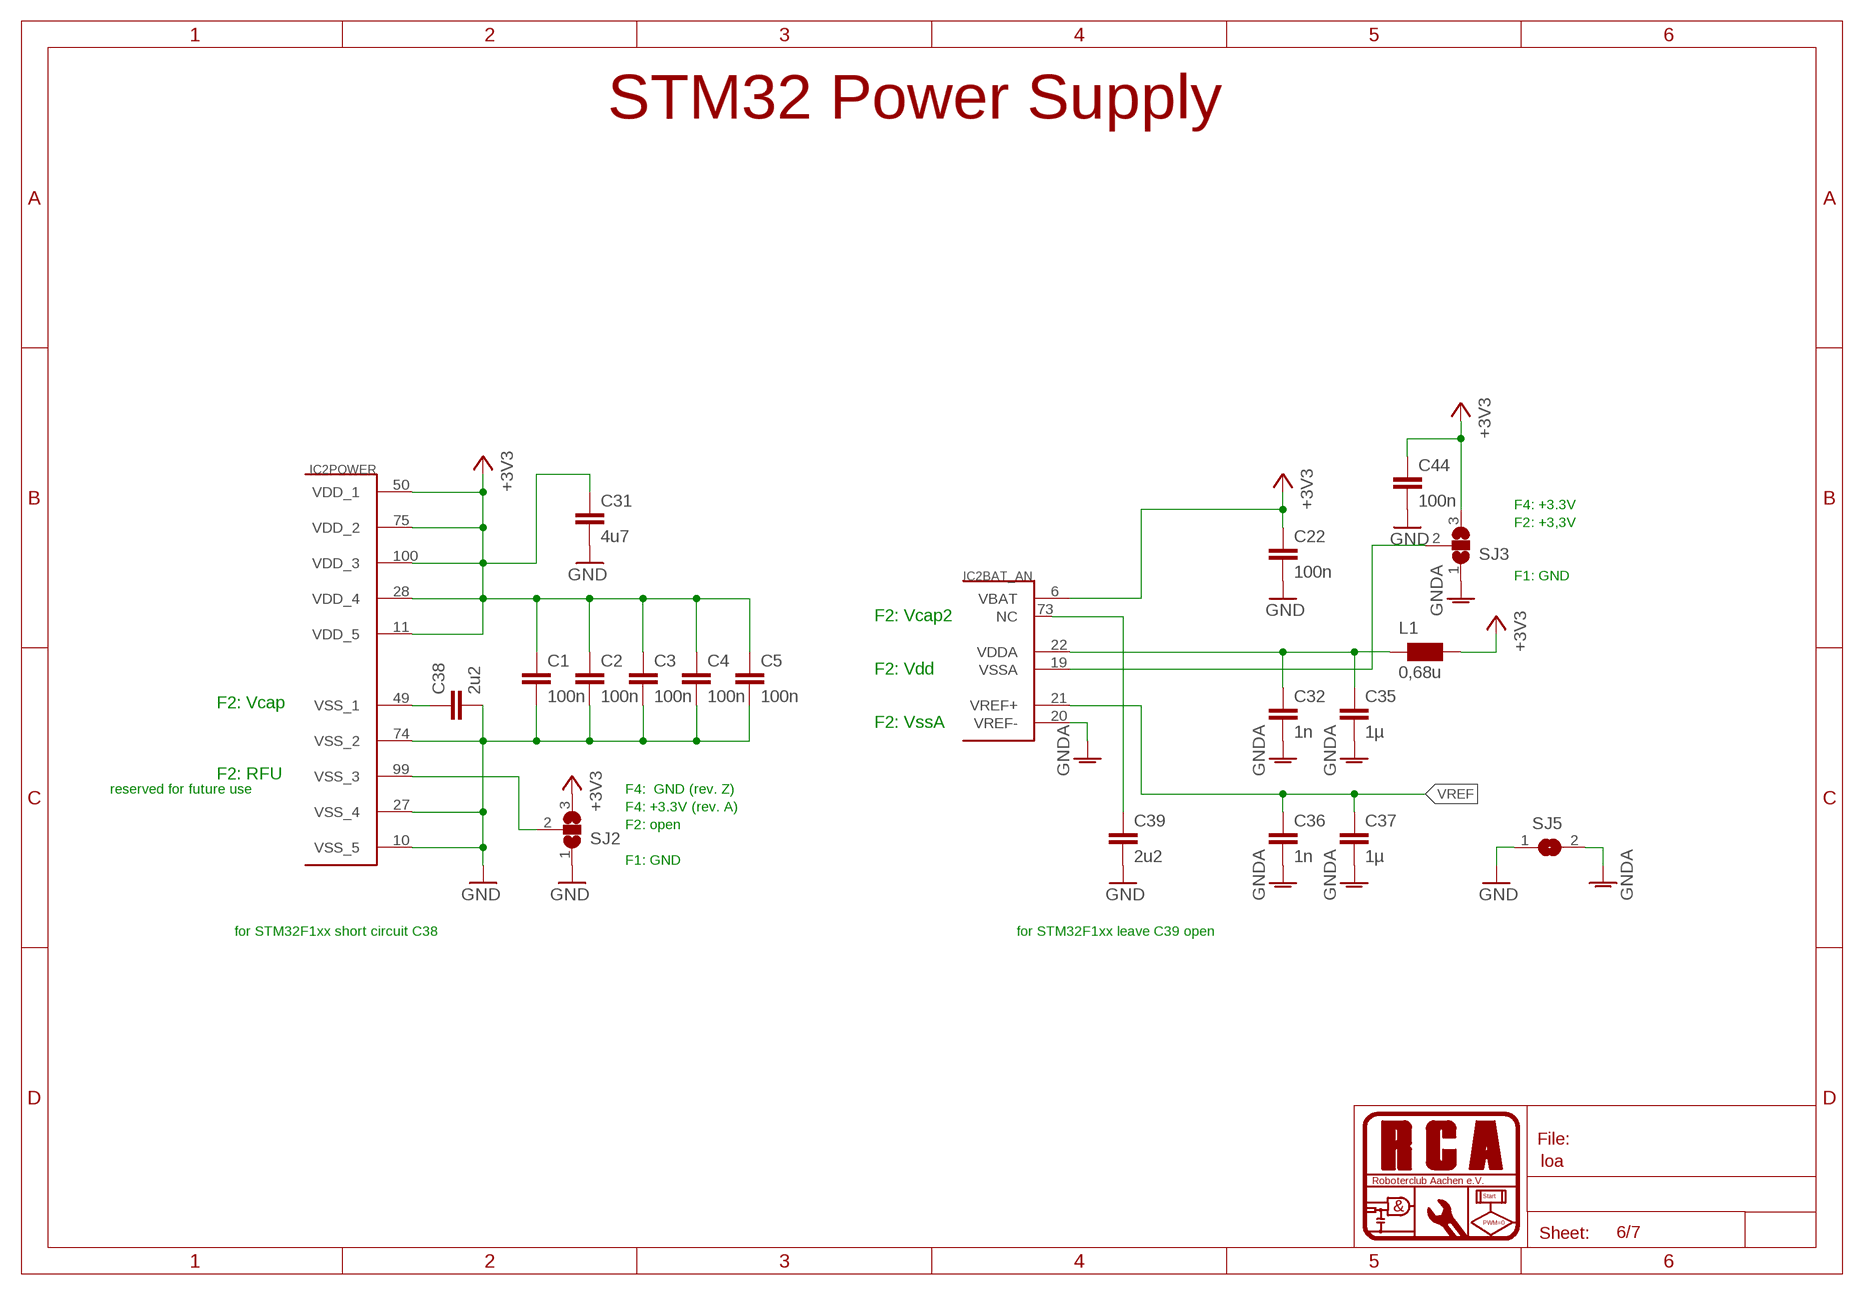
[diagram p5: schematic, sheet 6]

### Parts
C1  100n  C-EUC0603  [C0603]
C2  100n  C-EUC0603  [C0603]
C3  100n  C-EUC0603  [C0603]
C4  100n  C-EUC0603  [C0603]
C5  100n  C-EUC0603  [C0603]
C22  100n  C-EUC0603  [C0603]
C31  4u7  C-EUC0805  [C0805]
C32  1n  C-EUC0603  [C0603]
C35  1µ  C-EUC0805  [C0805]
C36  1n  C-EUC0603  [C0603]
C37  1µ  C-EUC0805  [C0805]
C38  2u2  C-EUC0805  [C0805]
C39  2u2  C-EUC0805  [C0805]
C44  100n  C-EUC0603  [C0603]
L1  0,68u  WE-KIHQ_0805  [WE-KI_0805_B]
SJ2  SJ2WS  [SJ_2S]
SJ3  SJ2WS  [SJ_2S]
SJ5  SJS  [SJS]

### Nets
+3V3: C1.1 C2.1 C3.1 C4.1 C5.1 C22.1 C31.1 C44.1 IC2.6(BAT_AN:VBAT) IC2.11(POWER:VDD_5) IC2.28(POWER:VDD_4) IC2.50(POWER:VDD_1) IC2.75(POWER:VDD_2) IC2.100(POWER:VDD_3) L1.1 SJ2.3 SJ3.3 ; also sheet 1,2,3,4,5,7
GND: C1.2 C2.2 C3.2 C4.2 C5.2 C22.2 C31.2 C38.2 C39.2 C44.2 IC2.10(POWER:VSS_5) IC2.27(POWER:VSS_4) IC2.74(POWER:VSS_2) SJ2.1 SJ5.1 ; also sheet 1,2,3,4,5,7
GNDA: C32.2 C35.2 C36.2 C37.2 IC2.20(BAT_AN:VREF-) SJ3.1 SJ5.2 ; also sheet 1
N$27: C38.1 IC2.49(POWER:VSS_1)
N$28: IC2.99(POWER:VSS_3) SJ2.2
N$29: C39.1 IC2.73(BAT_AN:NC)
N$30: IC2.19(BAT_AN:VSSA) SJ3.2
N$36: C32.1 C35.1 IC2.22(BAT_AN:VDDA) L1.2
VREF: C36.1 C37.1 IC2.21(BAT_AN:VREF+) ; also sheet 1

### Notes on the sheet
- STM32 Power Supply
- F4: +3.3V
- F2: +3,3V
- F1: GND
- F2: Vcap2
- F2: Vdd
- F2: Vcap
- F2: VssA
- F2: RFU
- reserved for future use | F4:  GND (rev. Z)
- F4: +3.3V (rev. A)
- F2: open
- F1: GND
- for STM32F1xx short circuit C38 | for STM32F1xx leave C39 open

## Sheet 7 of 7
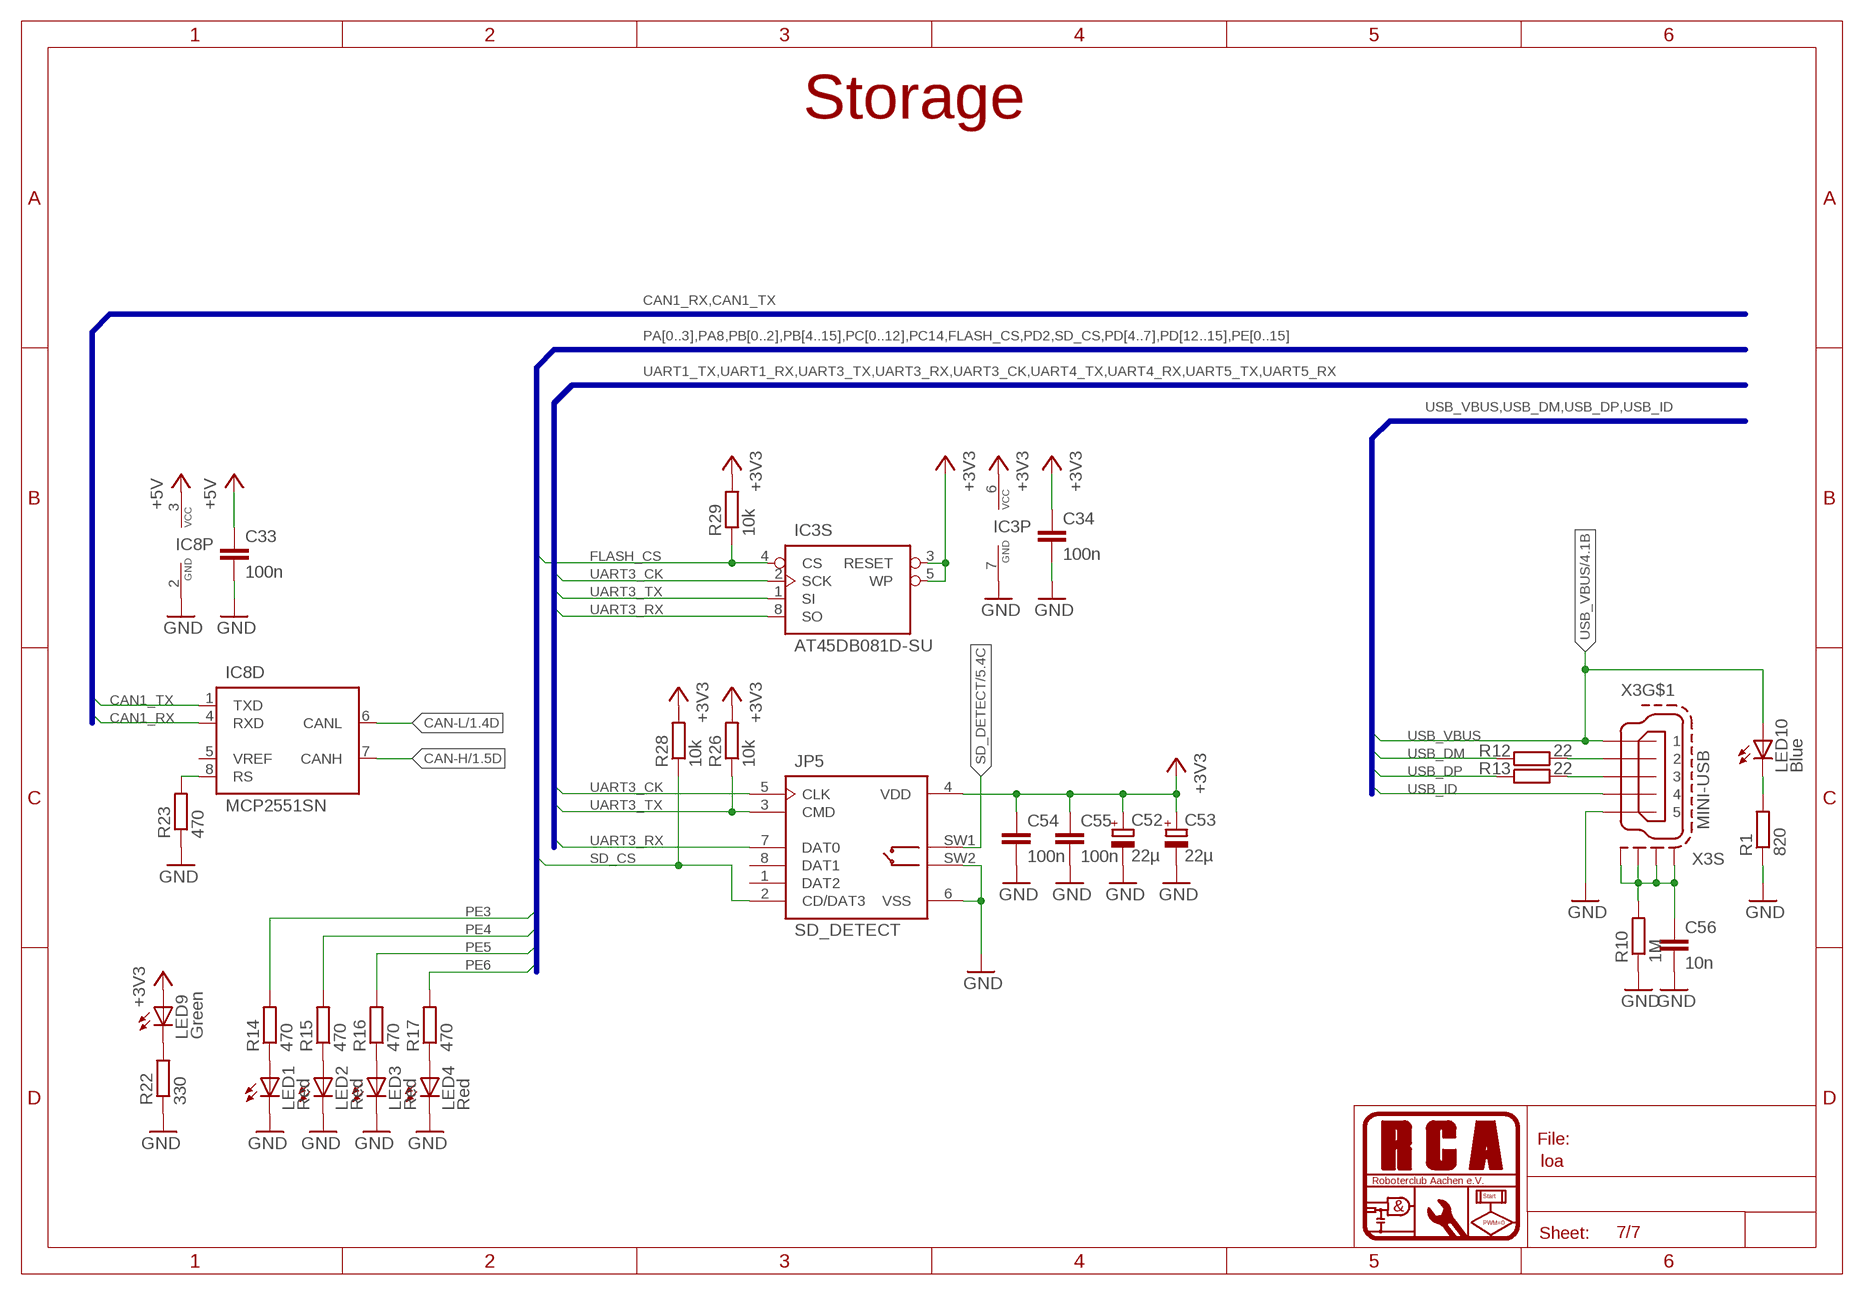
[diagram p6: schematic, sheet 7]

### Parts
C33  100n  C-EUC0603  [C0603]
C34  100n  C-EUC0805  [C0805]
C52  22µ  CPOL-EUSMCC  [SMC_C]
C53  22µ  CPOL-EUSMCC  [SMC_C]
C54  100n  C-EUC0603  [C0603]
C55  100n  C-EUC0603  [C0603]
C56  10n  C-EUC0603  [C0603]
IC3  AT45DB081D-SU  AT45DB041DS  [SO-08M]
IC8  MCP2551SN  [SOIC-8]
JP5  SD_DETECT  [SD_MOLEX_49225-0821]
LED1  Red  LEDCHIPLED_0805  [CHIPLED_0805]
LED2  Red  LEDCHIPLED_0805  [CHIPLED_0805]
LED3  Red  LEDCHIPLED_0805  [CHIPLED_0805]
LED4  Red  LEDCHIPLED_0805  [CHIPLED_0805]
LED9  Green  LEDCHIPLED_0805  [CHIPLED_0805]
LED10  Blue  LEDCHIPLED_0805  [CHIPLED_0805]
R1  820  R-EU_R0805  [R0805]
R10  1M  R-EU_R0805  [R0805]
R12  22  R-EU_R0805  [R0805]
R13  22  R-EU_R0805  [R0805]
R14  470  R-EU_R0805  [R0805]
R15  470  R-EU_R0805  [R0805]
R16  470  R-EU_R0805  [R0805]
R17  470  R-EU_R0805  [R0805]
R22  330  R-EU_R0805  [R0805]
R23  470  R-EU_R0805  [R0805]
R26  10k  R-EU_M0805  [M0805]
R28  10k  R-EU_M0805  [M0805]
R29  10k  R-EU_M0805  [M0805]
X3  MINI-USB  MINI-USB-SCHIELD-32005-201  [32005-201]

### Nets
+3V3: C34.1 C52.+ C53.+ C54.1 C55.1 IC3.3(S:RESET) IC3.5(S:WP) IC3.6(P:VCC) JP5.4(VDD) LED9.A R26.2 R28.2 R29.2 ; also sheet 1,2,3,4,5,6
+5V: C33.1 IC8.3(P:VCC) ; also sheet 4
CAN1_RX: IC8.4(D:RXD) ; also sheet 5
CAN1_TX: IC8.1(D:TXD) ; also sheet 5
CAN-H: IC8.7(D:CANH) ; also sheet 1
CAN-L: IC8.6(D:CANL) ; also sheet 1
FLASH_CS: IC3.4(S:CS) R29.1 ; also sheet 5
GND: C33.2 C34.2 C52.- C53.- C54.2 C55.2 C56.2 IC3.7(P:GND) IC8.2(P:GND) JP5.6(VSS) JP5.SW2 LED1.C LED2.C LED3.C LED4.C R1.1 R10.1 R22.1 R23.1 X3.5 ; also sheet 1,2,3,4,5,6
N$16: R12.2 X3.2
N$17: R13.2 X3.3
N$18: LED1.A R14.1
N$19: LED2.A R15.1
N$20: LED3.A R16.1
N$21: LED4.A R17.1
N$26: LED9.C R22.2
N$31: IC8.8(D:RS) R23.2
N$33: LED10.C R1.2
N$42: C56.1 R10.2 X3.M1(S:S1) X3.M2(S:S2) X3.M3(S:S3) X3.M4(S:S4)
PE3: R14.2 ; also sheet 5
PE4: R15.2 ; also sheet 5
PE5: R16.2 ; also sheet 5
PE6: R17.2 ; also sheet 5
SD_CS: JP5.2(CD/DAT3) R28.1 ; also sheet 5
SD_DETECT: JP5.SW1 ; also sheet 5
UART3_CK: IC3.2(S:SCK) JP5.5(CLK) ; also sheet 5
UART3_RX: IC3.8(S:SO) JP5.7(DAT0) ; also sheet 5
UART3_TX: IC3.1(S:SI) JP5.3(CMD) R26.1 ; also sheet 5
USB_DM: R12.1 ; also sheet 5
USB_DP: R13.1 ; also sheet 5
USB_ID: X3.4 ; also sheet 5
USB_VBUS: LED10.A X3.1 ; also sheet 4,5
Unconnected: IC8.5(D:VREF) JP5.1(DAT2) JP5.8(DAT1)

### Buses
USB_VBUS,USB_DM,USB_DP,USB_ID
CAN1_RX,CAN1_TX
UART1_TX,UART1_RX,UART3_TX,UART3_RX,UART3_CK,UART4_TX,UART4_RX,UART5_TX,UART5_RX
PA[0..3],PA8,PB[0..2],PB[4..15],PC[0..12],PC14,FLASH_CS,PD2,SD_CS,PD[4..7],PD[12..15],PE[0..15]

### Notes on the sheet
- Storage

## Library data of the parts
C1-C51 C54-C56 = rcl:C-EU: CAPACITOR, European symbol
C52 C53 = rcl:CPOL-EU: POLARIZED CAPACITOR, European symbol
D1 = diode:DIODE-: DIODE
D2 = diode:BAT54C: Schottky Diodes Source: Fairchild .. BAT54.pdf
IC1 = xilinx:XC3S*TQ144: Spartan-3 FPGA Low-cost Field Programmable Gate Array. Some pins may be unavailable on the XC3S50, check the datasheet for more information.
IC2 = stm32:STM32F10XVXT6: STM32F101/103 100 pin LQFP
IC3 = rca_ic:AT45DB: AT45DBxxxD Single 2.5V or 2.7V to 3.6V Supply Serial Interface: 66 MHz Maximum Clock Frequency AT45DB041D: 4,325,376 bits of memory as 2,048 pages of 256 bytes
IC4 = rca_spgversorgung:MCP182*
IC5 = rca_spgversorgung:MCP1700: MCP1700 Low Quiescent Current LDO Input Operating Voltage Range: 2.3V to 6.0V Output Voltage Range: 1.2V to 5.0V 250 mA Output Current for output voltages ≥ 2.5V 200 mA Output Current for output voltages < 2.5V Low Dropout (LDO) voltage 178 mV typical @ 250 mA for VOUT = 2.8V Standard Output Voltage Options: 1.2V 1.8V 2.5V 3.0V 3.3V 5.0V Stable with 1.0 ?F Ceramic Output capacitor Short-Circuit Protection Overtemperature Protection
IC6 = rca_ic:MCP3008: MCP3008 2.7V 4-Channel/8-Channel 10-Bit A/D Converters with SPI Serial Interface 10-bit resolution 4 (MCP3004) or 8 (MCP3008) input channels SPI serial interface (modes 0,0 and 1,1) Single supply operation: 2.7V - 5.5V 200 ksps max. sampling rate at VDD = 5V 75 ksps max. sampling rate at VDD = 2.7V Low power CMOS technology 5 nA typical standby current, 2 ?A max. 500 ?A max. active current at 5V Industrial temp range: -40°C to +85°C
IC7 = rca_spgversorgung:MIC5205: MIC5205 150mA Low-Noise LDO Regulator The MIC5205 is an efficient linear voltage regulator with ultra low-noise output, very low dropout voltage (typically 17mV at light loads and 165mV at 150mA), and very low ground current (600µA at 100mA output). The MIC5205 offers better than 1% initial accuracy.
IC8 = rca_ic:MCP2551: High-Speed CAN Transceiver
IC9 = rca_spgversorgung:LM4040: LM4040 Precision Micropower Shunt Voltage Reference Features: Small packages: SOT-23, TO-92 and SC70 No output capacitor required Tolerates capacitive loads Fixed reverse breakdown voltages of 2.048V, 2.500V, 3.000V, 4.096V, 5.000V, 8.192V, and 10.000V
JP1 = rca_stecker:CORTEX_JTAG
JP2 = pinhead2:PINHD-2X5: PIN HEADER
JP3 = jumper:JP1E: JUMPER
JP4 = pinhead2:PINHD-2X3: PIN HEADER
JP5 = rca_stecker:SD_DETECT
JP6 = pinhead2:PINHD-2X2: PIN HEADER
JP7 JP8 = pinhead2:PINHD-2X32
L1 L2 = wuerth-elektronik:WE-KIHQ: SMD Wire Wound Ceramic Inductor WE-KIHQ - High current - Highest Quality factor in size 0805 - up to 98 - High thermal stability - High SRF -- Bluetooth -- Wireless LAN -- RF oscillation circuit -- IF impedance matching -- IG choke
LED1-LED10 = led:LED: LED OSRAM: - CHIPLED LG R971, LG N971, LY N971, LG Q971, LY Q971, LO R971, LY R971 LH N974, LH R974 LS Q976, LO Q976, LY Q976 LO Q996 - Hyper CHIPLED LW Q18S LB Q993, LB Q99A, LB R99A - SideLED LS A670, LO A670, LY A670, LG A670, LP A670 LB A673, LV A673, LT A673, LW A673 LH A674 LY A675 LS A676, LA A676, LO A676, LY A676, LW A676 LS A679, LY A679, LG A679 - Hyper Micro SIDELED® LS Y876, LA Y876, LO Y876, LY Y876 LT Y87S - SmartLED LW L88C, LW L88S LB L89C, LB L89S, LG L890 LS L89K, LO L89K, LY L89K LS L896, LA L896, LO L896, LY L896 - TOPLED LS T670, LO T670, LY T670, LG T670, LP T670 LSG T670, LSP T670, LSY T670, LOP T670, LYG T670 LG T671, LOG T671, LSG T671 LB T673, LV T673, LT T673, LW T673 LH T674 LS T676, LA T676, LO T676, LY T676, LB T676, LH T676, LSB T676, LW T676 LB T67C, LV T67C, LT T67C, LS T67K, LO T67K, LY T67K, LW E67C LS E67B, LA E67B, LO E67B, LY E67B, LB E67C, LV E67C, LT E67C LW T67C LS T679, LY T679, LG T679 LS T770, LO T770, LY T770, LG T770, LP T770 LB T773, LV T773, LT T773, LW T773 LH T774 LS E675, LA E675, LY E675, LS T675 LS T776, LA T776, LO T776, LY T776, LB T776 LHGB T686 LT T68C, LB T68C - Hyper Mini TOPLED® LB M676 - Mini TOPLED Santana® LG M470 LS M47K, LO M47K, LY M47K Source: http://www.osram.convergy.de LUXEON: - LUMILED® LXK2-PW12-R00, LXK2-PW12-S00, LXK2-PW14-U00, LXK2-PW14-V00 LXK2-PM12-R00, LXK2-PM12-S00, LXK2-PM14-U00 LXK2-PE12-Q00, LXK2-PE12-R00, LXK2-PE12-S00, LXK2-PE14-T00, LXK2-PE14-U00 LXK2-PB12-K00, LXK2-PB12-L00, LXK2-PB12-M00, LXK2-PB14-N00, LXK2-PB14-P00, LXK2-PB14-Q00 LXK2-PR12-L00, LXK2-PR12-M00, LXK2-PR14-Q00, LXK2-PR14-R00 LXK2-PD12-Q00, LXK2-PD12-R00, LXK2-PD12-S00 LXK2-PH12-R00, LXK2-PH12-S00 LXK2-PL12-P00, LXK2-PL12-Q00, LXK2-PL12-R00 Source: www.luxeon.com KINGBRIGHT: KA-3528ASYC Source: www.kingbright.com
Q1 Q2 = rca_sontiges:XO: XO91 Series Oscillators Frequency Range 500 kHz to 125 MHz Supply voltage range 1.8, 2.5, 3.3 or 5.0 Volts Gibt es in der 3,3V Version bei Reichelt (XO91 #Wert) Datenblatt: http://www.reichelt.de/?;ACTION=7;LA=6;OPEN=0;INDEX=0;FILENAME=B400%252FXO91.pdf XO53 Series Oscillators Frequency Range 2.5 MHz to 125 MHz Supply voltage range 1.8, 2.5, 3.3 Volts Gibt es in der 3,3V Version bei Reichelt (XO53 #Wert)
R1-R10 R12-R23 R25 R26 R28 R29 R33 = rcl:R-EU_: RESISTOR, European symbol
RN1-RN5 = resistor-dil:4R-N: Array Chip Resistor Source: RS Component / Phycomp
S1-S5 = rca_sontiges:10-XX*: OMRON SWITCH
SJ1 SJ5 = rca_sontiges:SJ: SMD solder JUMPER
SJ2 SJ3 = rca_sontiges:SJ2W: SMD solder JUMPER
SJ4 = jumper:SJ: SMD solder JUMPER
X3 = con-cypressindustries:MINI-USB-SCHIELD-: MINI USB-B Conector Source: www.cypressindustries.com